# Altium schematic sheet Capstone_Motor_Driver.SchDoc
size A
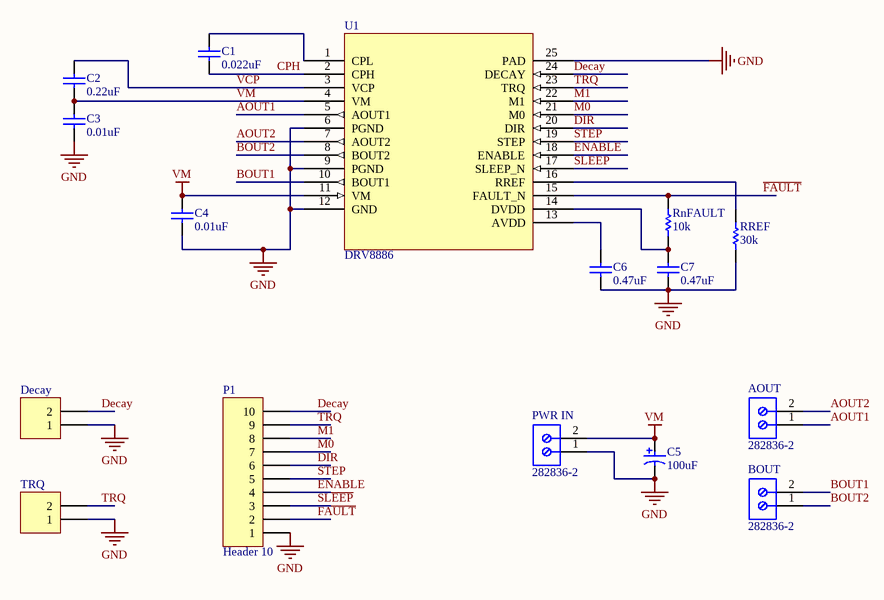
[diagram p0: Capstone_Motor_Driver.SchDoc]

## Parts
AOUT  282836-2  [TECO-282836-2_V]
BOUT  282836-2  [TECO-282836-2_V]
C1  0.022uF  [CAPC2013X94X50ML20T25]
C2  0.22uF  [CAPC2013X145X50NL20T25]
C3  0.01uF  [CAPC2013X88X50ML20T25]
C4  0.01uF  [CAPC2013X88X50ML20T25]
C5  100uF  [PNSC-FK-V-F_V]
C6  0.47uF  [CAPC2013X110X50NL20T25]
C7  0.47uF  [CAPC2013X110X50NL20T25]
Decay  Header 2  [HDR1X2]  (value not drawn)
P1  Header 10  [HDR1X10]
PWR_IN  282836-2  [TECO-282836-2_V]
RnFAULT  10k  [RESC2013X60X40LL20T25_A]
RREF  30k  [RESC2013X60X40LL20T25_A]
TRQ  Header 2  [HDR1X2]  (value not drawn)
U1  DRV8886  [PWP0024B_N]

## Nets
GND: C3.1 C4.1 C5.2 C6.1 C7.1 Decay.1 P1.1 PWR_IN.1 RREF.1 TRQ.1 U1.6(PGND) U1.9(PGND) U1.12(GND) U1.25(PAD)
VM: C2.1 C3.2 C4.2 C5.1 PWR_IN.2 U1.4(VM) U1.11(VM)
~{FAULT}: P1.2 RnFAULT.2 U1.15(FAULT_N)
~{SLEEP}: P1.3 U1.17(SLEEP_N)
AOUT1: AOUT.1 U1.5(AOUT1)
AOUT2: AOUT.2 U1.7(AOUT2)
BOUT1: BOUT.2 U1.10(BOUT1)
BOUT2: BOUT.1 U1.8(BOUT2)
CPH: C1.1 U1.2(CPH)
Decay: Decay.2 P1.10 U1.24(DECAY)
DIR: P1.6 U1.20(DIR)
ENABLE: P1.4 U1.18(ENABLE)
M0: P1.7 U1.21(M0)
M1: P1.8 U1.22(M1)
STEP: P1.5 U1.19(STEP)
TRQ: P1.9 TRQ.2 U1.23(TRQ)
VCP: C2.2 U1.3(VCP)
NetC1_2: C1.2 U1.1(CPL)
NetC6_2: C6.2 U1.13(AVDD)
NetC7_2: C7.2 RnFAULT.1 U1.14(DVDD)
NetRREF_2: RREF.2 U1.16(RREF)

## Library data of the parts
AOUT BOUT PWR_IN = CMP-1684-00017-1: Female Header, Pitch 5 mm, 1 x 2 Position, Height 10 mm, Tail Length 3.5 mm, Rohs, Bulk; Manufacturer: TE Connectivity; Wire Gauge: 16-30AWG; Product Training Modules: Wire-to-BoardEurostyleTerminalBlocks; Clamp Material - Plating: Brass-NickelPlated; Voltage: 300V; Mating Orientation: HorizontalwithBoard; Current: 13.5A; Pitch: 0.197"(5.00mm); Screw Thread: M3; 3D Model: 282836-2.pdf; Other Names: 5ULV-02B / A98076; Dynamic Catalog: BuchananSeries; Number of Levels: 1; Torque - Screw: 0.68Nm(6Lb-In); Featured Product: EurostyleTerminalBlockConnectors; Positions Per Level: 2; Wire Termination: Screw-RisingCageClamp; Datasheet URL: http://www.te.com.cn/commerce/DocumentDelivery/DDEController?Action=showdoc&DocId=Catalog+Section%7F1308389_EUROSTYLE_TERMINAL_BLOCKS%7F0607%7Fpdf%7FEnglish%7FENG_CS_1308389_EUROSTYLE_TERMINAL_BLOCKS_0607.pdf%7F282836-2; Color: Green; Family: TerminalBlocks-WiretoBoard; RoHS Information: 282836-2StatementofCompliance; Standard Package: 300; Contact Material - Plating: Brass-TinPlated; Manufacturer URL: http://www.te.com; Housing Material: Polyamide(PA66),Nylon6/6; Features: Interlocking(Side); Package Description: Female Header, Pitch 5 mm, 1 x 2 Position, Height 10 mm, Tail Length 3.5 mm; Mounting Type: ThroughHole; Package Reference: THD; Packaging: Bulk; Series: Buchanan; Category: Connectors,Interconnects; Screw Material - Plating: Brass-NickelPlated
C1 = CMP-2007-04396-1: Manufacturer: AVX Interconnect / Elco; Part Number: 08055C223JAT2A
C2 = CMP-2007-01163-1: 0805; Part Number: C0805C224K5RAC7800; Manufacturer: Kemet
C3 C4 = CMP-2007-00254-1: 0805; Manufacturer: Kemet; Part Number: C0805C103J5RACTU
C5 = CMP-2000-06208-1: Aluminum Electrolytic Capacitor, 100 uF, +/- 20%, 50 V, 2-Pin SMD (Size Code F), -55 to 105 degC, RoHS, Tape and Reel; Manufacturer: Panasonic; Impedance: 0.34O; Lifetime@Temperature: 2000Hrs@105°C; Ripple Current: 350mA; Type: Can; Rated Voltage: 50V; Capacitance: 100µF; Mounting Technology: SurfaceMount; Series: FK; Package URL: http://industrial.panasonic.com/cdbs/www-data/pdf/RDE0000/DME0000COL48.pdf; Datasheet URL: http://industrial.panasonic.com/cdbs/www-data/pdf/RDE0000/ABA0000C1181.pdf; Package Reference: FK-V-F; Operating Temp-Max: 105°C; Manufacturer URL: http://www.panasonic.com/; Operating Temp Range: -55to+105°C; Package Description: 2-Pin Electrolytic Aluminum Capacitor, Body 8.3 x 8.3 mm; Datasheet Version: 03/2016; Case Size/Dimension: Ø8x10.2mm
C6 C7 = CMP-2007-03659-1: 0805; Manufacturer: Kemet; Part Number: C0805C474K5RACTU
Decay TRQ = Header 2: Header, 2-Pin; LatestRevisionDate: 17-Jul-2002; LatestRevisionNote: Re-released for DXP Platform.; Publisher: Altium Limited
P1 = Header 10: Header, 10-Pin; LatestRevisionDate: 17-Jul-2002; LatestRevisionNote: Re-released for DXP Platform.; Publisher: Altium Limited
RnFAULT RREF = CMP-2000-06228-1: Metal Film Chip Resistor, High Reliability Type, 0.125 W, +/- 0.1%, -55 to 155 degC, 0805 (2012 Metric), RoHS, Tape and Reel; Voltage Rating: 100V; Power Rating: 125mW(1/8W); Brand: Panasonic; Temperature Coefficient: 25PPM/C; Resistance: 10kOhms; Product Category: ThinFilmResistors-SMD; Datasheet Version: 02/2016; Operating Temperature Range: -55Cto+155C; Length: 2mm; Mounting Technology: SurfaceMount; Manufacturer URL: http://www.panasonic.com/; Width: 1.25mm; Packaging: Reel; Product: ThinFilmResistorsSMD; Package / Case: 0805(2012metric); Termination Style: SMD/SMT; Tolerance: 0.1%; Datasheet URL: https://industrial.panasonic.com/cdbs/www-data/pdf/RDM0000/AOA0000C307.pdf; Package Description: 2-Pin Surface Mount Device, Body 2 x 1.25 mm; Factory Pack Quantity: 5000; Series: ERA-6A; Case Code - mm: 2012; RoHS: Details; Package Reference: 0805; Height: 0.5mm; Manufacturer: Panasonic; Case Code - in: 0805; Type: MetalFilmChipResistors